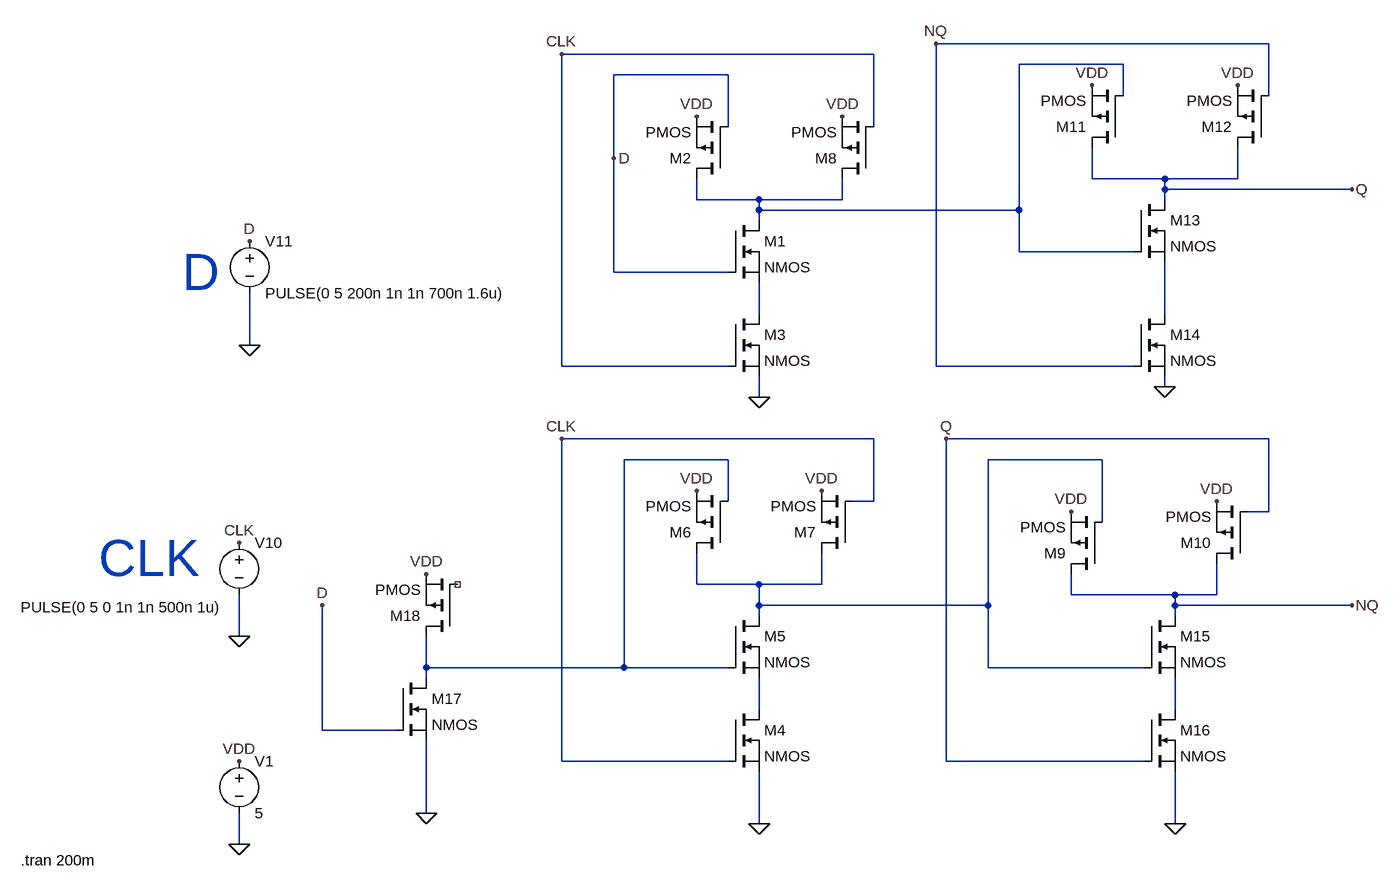
[diagram p0: schematic Dlatch.asc]
Dlatch.asc, the LTspice schematic file:
Version 4.1
SHEET 1 1380 1524
WIRE 768 48 256 48
WIRE 160 64 -320 64
WIRE 544 80 384 80
WIRE -64 96 -240 96
WIRE 544 128 544 80
WIRE 768 128 768 48
WIRE -64 176 -64 96
WIRE 160 176 160 64
WIRE -240 224 -240 96
WIRE 496 256 496 208
WIRE 608 256 496 256
WIRE 720 256 720 208
WIRE 720 256 608 256
WIRE 608 272 608 256
WIRE 896 272 608 272
WIRE -112 288 -112 256
WIRE -16 288 -112 288
WIRE 112 288 112 256
WIRE 112 288 -16 288
WIRE 608 288 608 272
WIRE -16 304 -16 288
WIRE 384 304 384 80
WIRE 384 304 -16 304
WIRE -16 320 -16 304
WIRE 384 368 384 304
WIRE 560 368 384 368
WIRE -240 400 -240 224
WIRE -64 400 -240 400
WIRE -16 464 -16 416
WIRE 608 464 608 384
WIRE -800 512 -800 432
WIRE -320 544 -320 64
WIRE -64 544 -320 544
WIRE 256 544 256 48
WIRE 560 544 256 544
WIRE 608 576 608 560
WIRE -16 592 -16 560
WIRE 160 656 -320 656
WIRE 768 656 272 656
WIRE -64 688 -224 688
WIRE 512 688 336 688
WIRE -64 752 -64 688
WIRE 160 752 160 656
WIRE 160 752 128 752
WIRE 768 768 768 656
WIRE 768 768 736 768
WIRE 512 784 512 688
WIRE -112 880 -112 832
WIRE -16 880 -112 880
WIRE 80 880 80 832
WIRE 80 880 -16 880
WIRE 464 896 464 864
WIRE 624 896 464 896
WIRE 688 896 688 848
WIRE 688 896 624 896
WIRE -16 912 -16 880
WIRE 336 912 336 688
WIRE 336 912 -16 912
WIRE 624 912 624 896
WIRE 896 912 624 912
WIRE -16 928 -16 912
WIRE 624 928 624 912
WIRE -816 960 -816 896
WIRE -528 1008 -528 960
WIRE -224 1008 -224 688
WIRE -224 1008 -528 1008
WIRE -64 1008 -224 1008
WIRE 336 1008 336 912
WIRE 576 1008 336 1008
WIRE -528 1024 -528 1008
WIRE -16 1072 -16 1024
WIRE 624 1072 624 1024
WIRE -688 1104 -688 912
WIRE -576 1104 -688 1104
WIRE -320 1152 -320 656
WIRE -64 1152 -320 1152
WIRE 272 1152 272 656
WIRE 576 1152 272 1152
WIRE -528 1232 -528 1120
WIRE -16 1248 -16 1168
WIRE 624 1248 624 1168
WIRE -816 1280 -816 1232
FLAG -16 592 0
FLAG 608 576 0
FLAG 624 1248 0
FLAG -16 1248 0
FLAG -528 1232 0
FLAG -816 960 0
FLAG -800 512 0
FLAG -816 1280 0
FLAG -816 1152 VDD
FLAG -800 352 D
FLAG -240 224 D
FLAG -688 912 D
FLAG -816 816 CLK
FLAG -320 64 CLK
FLAG -320 656 CLK
FLAG 896 272 Q
FLAG 896 912 NQ
FLAG 272 656 Q
FLAG 256 48 NQ
FLAG -112 160 VDD
FLAG 112 160 VDD
FLAG 496 112 VDD
FLAG 720 112 VDD
FLAG -112 736 VDD
FLAG 80 736 VDD
FLAG 464 768 VDD
FLAG 688 752 VDD
FLAG -528 864 VDD
SYMBOL nmos -64 320 R0
SYMATTR InstName M1
SYMBOL pmos -64 256 R180
SYMATTR InstName M2
SYMBOL nmos -64 464 R0
SYMATTR InstName M3
SYMBOL nmos -64 1072 R0
SYMATTR InstName M4
SYMBOL nmos -64 928 R0
SYMATTR InstName M5
SYMBOL pmos -64 832 R180
SYMATTR InstName M6
SYMBOL pmos 128 832 R180
SYMATTR InstName M7
SYMBOL pmos 160 256 R180
SYMATTR InstName M8
SYMBOL pmos 512 864 R180
SYMATTR InstName M9
SYMBOL pmos 736 848 R180
SYMATTR InstName M10
SYMBOL pmos 544 208 R180
SYMATTR InstName M11
SYMBOL pmos 768 208 R180
SYMATTR InstName M12
SYMBOL nmos 560 288 R0
SYMATTR InstName M13
SYMBOL nmos 560 464 R0
SYMATTR InstName M14
SYMBOL nmos 576 928 R0
SYMATTR InstName M15
SYMBOL nmos 576 1072 R0
SYMATTR InstName M16
SYMBOL nmos -576 1024 R0
SYMATTR InstName M17
SYMBOL pmos -480 960 R180
SYMATTR InstName M18
SYMBOL voltage -816 800 R0
WINDOW 123 0 0 Left 0
WINDOW 39 0 0 Left 0
WINDOW 3 -336 115 Left 2
SYMATTR InstName V10
SYMATTR Value PULSE(0 5 0 1n 1n 500n 1u)
SYMBOL voltage -800 336 R0
WINDOW 123 0 0 Left 0
WINDOW 39 0 0 Left 0
SYMATTR InstName V11
SYMATTR Value PULSE(0 5 200n 1n 1n 700n 1.6u)
SYMBOL voltage -816 1136 R0
WINDOW 123 0 0 Left 0
WINDOW 39 0 0 Left 0
SYMATTR InstName V1
SYMATTR Value 5
TEXT -904 400 Left 6 ;D
TEXT -1032 840 Left 6 ;CLK
TEXT -1152 1304 Left 2 !.tran 200m

The netlist it stands for:
* Dlatch.asc
M1 N001 D N002 N002 NMOS
M2 N001 D VDD VDD PMOS
M3 N002 CLK 0 0 NMOS
M4 N006 CLK 0 0 NMOS
M5 N005 N004 N006 N006 NMOS
M6 N005 N004 VDD VDD PMOS
M7 N005 CLK VDD VDD PMOS
M8 N001 CLK VDD VDD PMOS
M9 NQ N005 VDD VDD PMOS
M10 NQ Q VDD VDD PMOS
M11 Q N001 VDD VDD PMOS
M12 Q NQ VDD VDD PMOS
M13 Q N001 N003 N003 NMOS
M14 N003 NQ 0 0 NMOS
M15 NQ N005 N007 N007 NMOS
M16 N007 Q 0 0 NMOS
M17 N004 D 0 0 NMOS
M18 N004 NC_01 VDD VDD PMOS
V10 CLK 0 PULSE(0 5 0 1n 1n 500n 1u)
V11 D 0 PULSE(0 5 200n 1n 1n 700n 1.6u)
V1 VDD 0 5
.model NMOS NMOS
.model PMOS PMOS
.lib standard.mos
* D
* CLK
.tran 200m
.backanno
.end